# EAGLE design light (EAGLE 8.5.0)
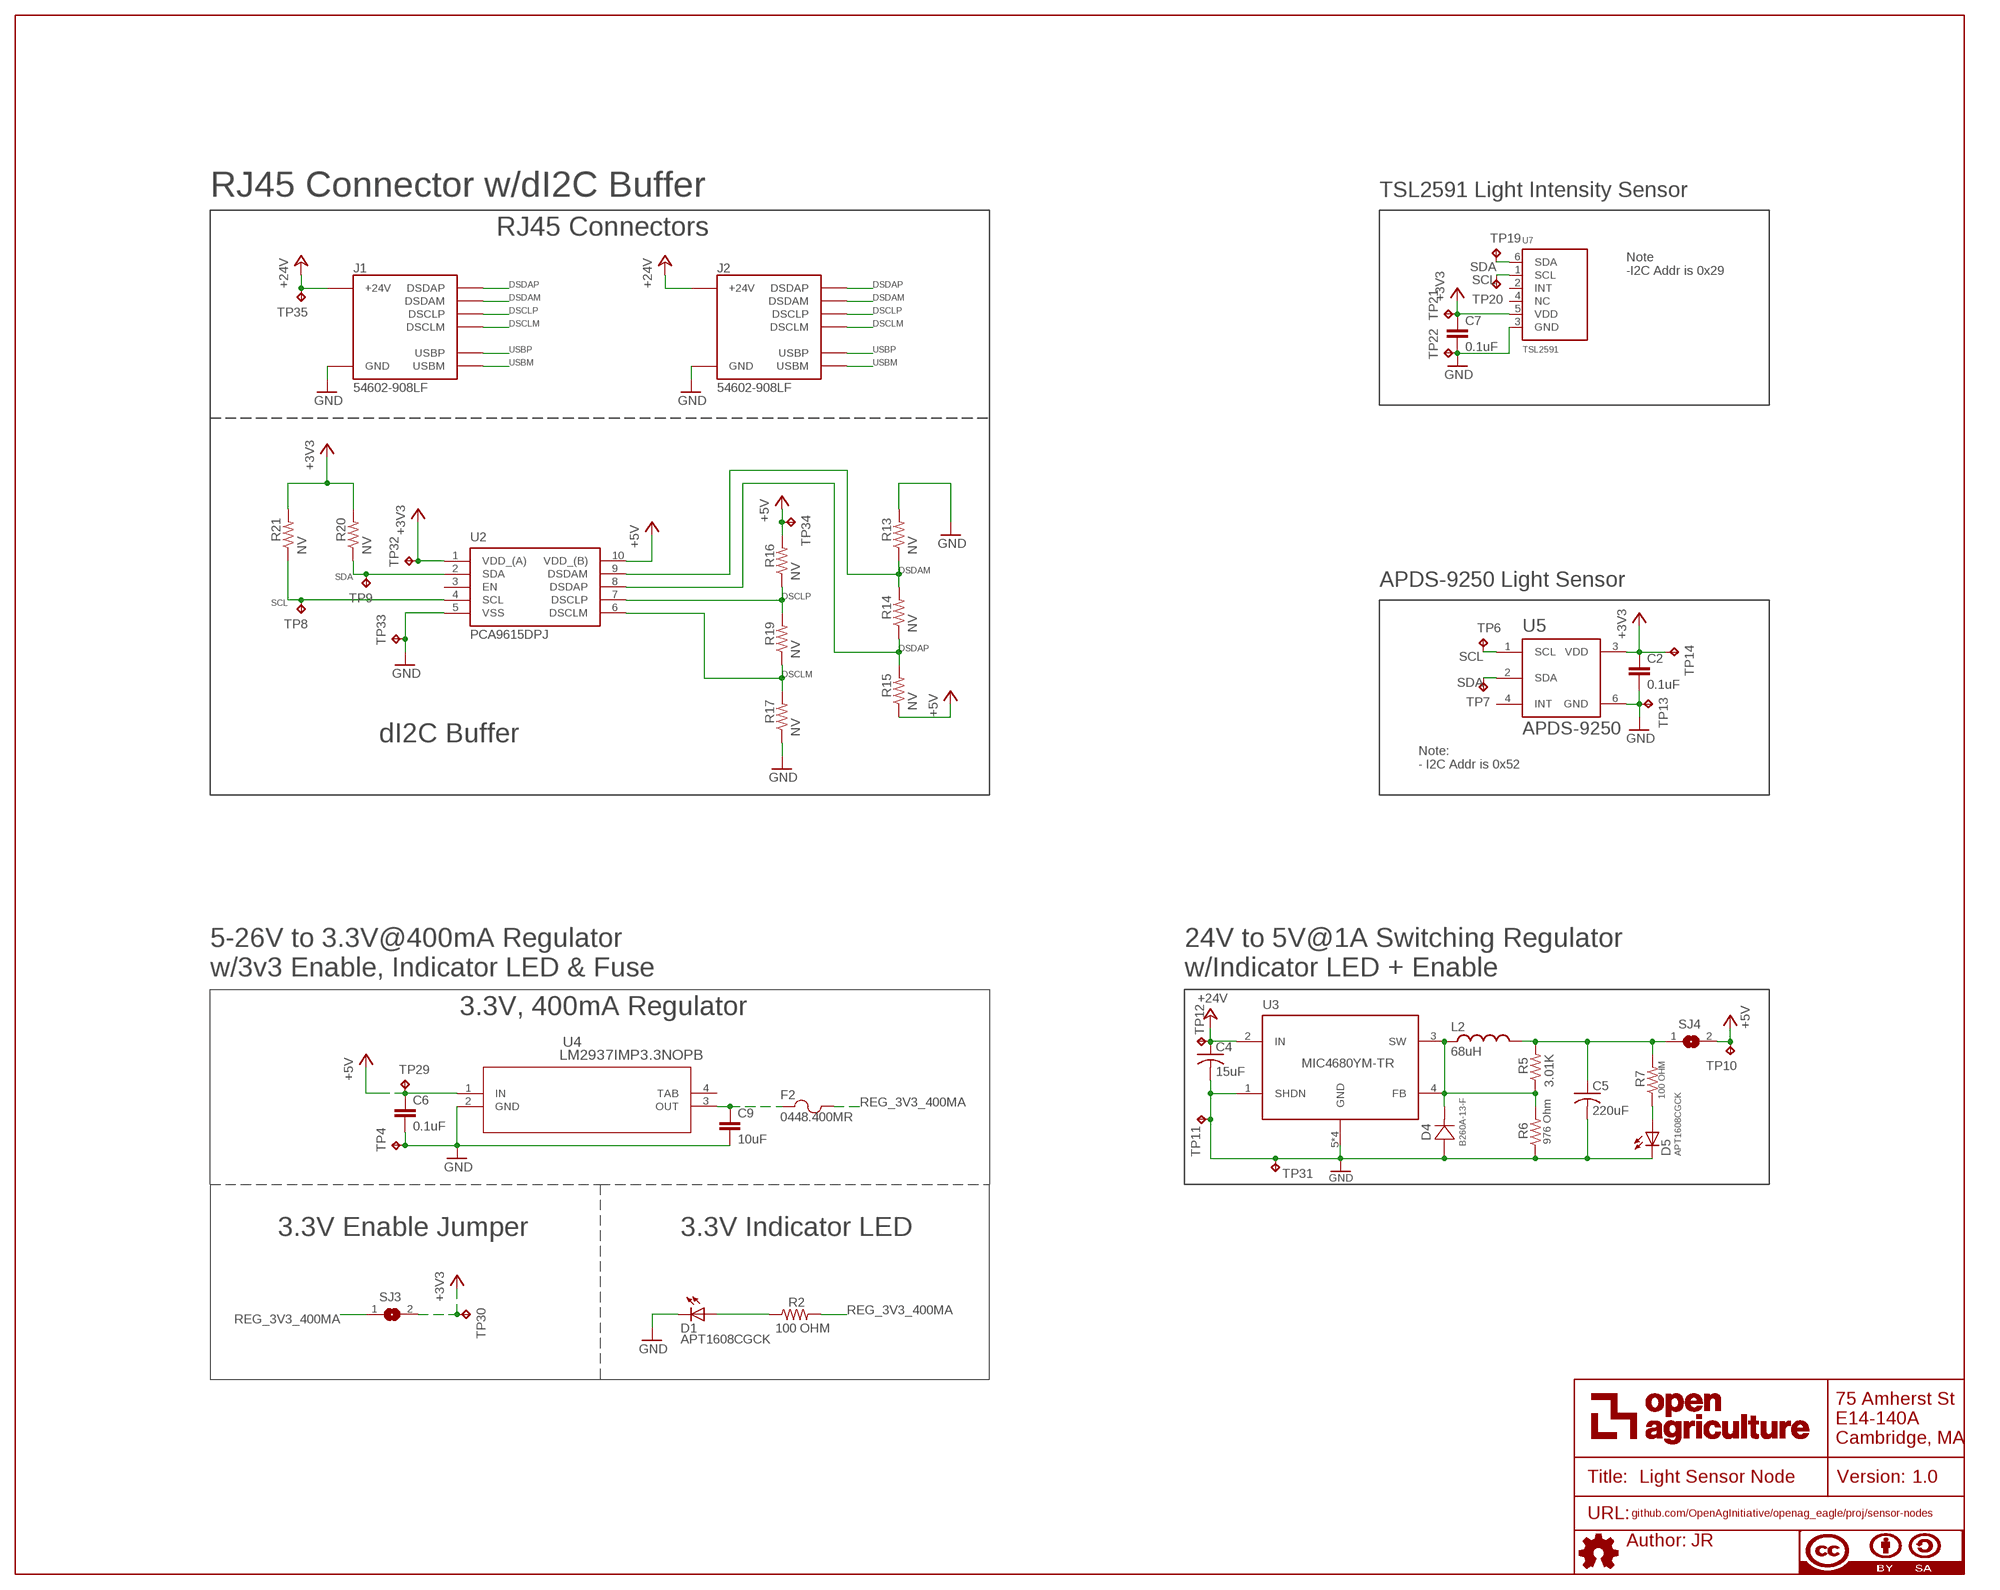
[diagram p0: schematic, sheet 1]

## Parts
C2  0.1uF  0.1UF-C0603C104K5RACTU  [C0603]
C4  15uF  15UF-TPSD156K035R0100  [CT7343]
C5  220uF  220UF-TPSY227K010R0100  [CT7343]
C6  0.1uF  0.1UF-C0603C104K5RACTU  [C0603]
C7  0.1uF  0.1UF-C0603C104K5RACTU  [C0603]
C9  10uF  10UF-GMK212BBJ106KG-T  [C0805]
D1  APT1608CGCK  [CHIPLED_0603]
D4  B260A-13-F  [SMA]
D5  APT1608CGCK  [CHIPLED_0603]
F2  0448.400MR  0438.375WR  [0603]
FRAME1  DOCFIELD  [DOCFIELD]
J1  54602-908LF  OPENAG-V1-RJ45PTH  [OPENAG-V1-RJ45]
J2  54602-908LF  OPENAG-V1-RJ45PTH  [OPENAG-V1-RJ45]
L2  68uH  68UH-UP2B-680-R  [UP2B]
R2  100 OHM  100OHM-RC0603JR-07100RL  [RC0603N]
R5  3.01K  3.01K-RC0603FR-073K01L  [RC0603N]
R6  976 Ohm  982OHM-RC0603FR-07976RL  [RC0603N]
R7  100 OHM  100OHM-RC0603JR-07100RL  [RC0603N]
R13  NV  R0603  [RC0603N]
R14  NV  R0603  [RC0603N]
R15  NV  R0603  [RC0603N]
R16  NV  R0603  [RC0603N]
R17  NV  R0603  [RC0603N]
R19  NV  R0603  [RC0603N]
R20  NV  R0603  [RC0603N]
R21  NV  R0603  [RC0603N]
SJ3  SOLDERJUMPERREFLOW_NOPASTE  [SOLDERJUMPER_REFLOW_NOPASTE]
SJ4  SOLDERJUMPERREFLOW_NOPASTE  [SOLDERJUMPER_REFLOW_NOPASTE]
TP4  TPTP06R  [TP06R]
TP6  TPTP06R  [TP06R]
TP7  TPTP06R  [TP06R]
TP8  TPTP06R  [TP06R]
TP9  TPTP06R  [TP06R]
TP10  TPTP06R  [TP06R]
TP11  TPTP06R  [TP06R]
TP12  TPTP06R  [TP06R]
TP13  TPTP06R  [TP06R]
TP14  TPTP06R  [TP06R]
TP19  TPTP06R  [TP06R]
TP20  TPTP06R  [TP06R]
TP21  TPTP06R  [TP06R]
TP22  TPTP06R  [TP06R]
TP29  TPTP06R  [TP06R]
TP30  TPTP06R  [TP06R]
TP31  TPTP06R  [TP06R]
TP32  TPTP06R  [TP06R]
TP33  TPTP06R  [TP06R]
TP34  TPTP06R  [TP06R]
TP35  TPTP06R  [TP06R]
U2  PCA9615DPJ  [SOP50P490X110-10N]
U3  MIC4680YM-TR  [SOIC8]
U4  LM2937IMP3.3NOPB  LM2937IMP-3.3/NOPB  [MP04A]
U5  APDS-9250  [APDS-9250]
U7  TSL2591  TSL25911FN  [DFN6_TAOS]

## Nets
+3V3: C2.1 C7.1 R20.2 R21.2 SJ3.2 TP14.TP TP21.TP TP30.TP TP32.TP U2.1(VDD_(A)) U5.3(VDD) U7.5(VDD)
+5V: C6.1 R15.1 R16.2 SJ4.2 TP10.TP TP29.TP TP34.TP U2.10(VDD_(B)) U4.1(IN)
+24V: C4.+(1(+)) J1.24V(6)(+24V) J2.24V(6)(+24V) TP12.TP TP35.TP U3.2(IN)
DSCLM: J1.DSCLM(5)(DSCLM) J2.DSCLM(5)(DSCLM) R17.2 R19.1 U2.6(DSCLM)
DSCLP: J1.DSCLP(4)(DSCLP) J2.DSCLP(4)(DSCLP) R16.1 R19.2 U2.7(DSCLP)
DSDAM: J1.DSDAM(2)(DSDAM) J2.DSDAM(2)(DSDAM) R13.1 R14.2 U2.9(DSDAM)
DSDAP: J1.DSDAP(1)(DSDAP) J2.DSDAP(1)(DSDAP) R14.1 R15.2 U2.8(DSDAP)
GND: C2.2 C4.-(2(-)) C5.-(2(-)) C6.2 C7.2 C9.2 D1.C D4.2 D5.C J1.GND(3)(GND) J2.GND(3)(GND) R6.1 R13.2 R17.1 TP4.TP TP11.TP TP13.TP TP22.TP TP31.TP TP33.TP U2.5(VSS) U3.1(SHDN) U3.5(GND) U3.6(GND) U3.7(GND) U3.8(GND) U4.2(GND) U5.6(GND) U7.3(GND)
N$4: D1.A R2.1
N$5: C9.1 F2.1 U4.3(OUT)
N$31: D4.1 L2.1 R5.1 R6.2 U3.3(SW) U3.4(FB)
N$32: D5.A R7.1
N$33: C5.+(1(+)) L2.2 R5.2 R7.2 SJ4.1
REG_3V3_400MA: F2.2 R2.2 SJ3.1
SCL: R21.1 TP6.TP TP8.TP TP20.TP U2.4(SCL) U5.1(SCL) U7.1(SCL)
SDA: R20.1 TP7.TP TP9.TP TP19.TP U2.2(SDA) U5.2(SDA) U7.6(SDA)
USBM: J1.USBM(8)(USBM) J2.USBM(8)(USBM)
USBP: J1.USBP(7)(USBP) J2.USBP(7)(USBP)
Unconnected: U2.3(EN) U5.4(INT) U7.2(INT) U7.4(NC)

## Notes on the sheet
- RJ45 Connector w/dI2C Buffer | TSL2591 Light Intensity Sensor
- RJ45 Connectors
- Note
  -I2C Addr is 0x29
- APDS-9250 Light Sensor
- dI2C Buffer
- Note:
  - I2C Addr is 0x52
- 5-26V to 3.3V@400mA Regulator 
  w/3v3 Enable, Indicator LED & Fuse
- 24V to 5V@1A Switching Regulator
  w/Indicator LED + Enable
- 3.3V, 400mA Regulator
- 3.3V Enable Jumper | 3.3V Indicator LED

## Power pins joined to a net without a drawn wire
TAB: U4.4(TAB)

## Library data of the parts
C2 C6 C7 = openag-capacitors:0.1UF-C0603C104K5RACTU: Kemet - C0603C104K5RACTU - CAP CER 0.1UF 50V X7R 0603 Description: 0.1µF ±10% 50V Ceramic Capacitor X7R 0603 (1608 Metric) Technical Specifications: Capacitance: 0.1µF Tolerance: ±10% Rated Voltage: 50V Temperature Coefficient: X7R Operating Temperature: -55°C ~ 125°C Package / Case: 0603 (1608 Metric) Datasheet(s): X7R Dielectric, 6.3-250 VDC <https://search.kemet.com/component-edge/download/datasheet/C0603C104K5RACTU.pdf> Vendor(s): Digikey: 399-5089-1-ND <https://www.digikey.com/product-detail/en/kemet/C0603C104K5RACTU/399-5089-1-ND/1465623>; POPULATE: YES; VERIFIED: NO
C4 = openag-capacitors:15UF-TPSD156K035R0100: AVX Corporation - TPSD156K035R0100 - CAP TANT 15UF 35V 10% 2917 Description: 15µF Molded Tantalum Capacitors 35V 2917 (7343 Metric) 100 mOhm Technical Specifications: Capacitance: 15µF Tolerance: ±10% Voltage - Rated: 35V Type: Molded ESR (Equivalent Series Resistance): 100 mOhm Operating Temperature: -55°C ~ 125°C Mounting Type: Surface Mount Package / Case: 2917 (7343 Metric) Size / Dimension: 0.287" L x 0.169" W (7.30mm x 4.30mm) Height - Seated (Max): 0.122" (3.10mm) Manufacturer Size Code: D Features: General Purpose Datasheet(s): TPS Series, Low ESR <http://datasheets.avx.com/TPS.pdf> Vendor(s): Digikey: 478-4100-1-ND <https://www.digikey.com/scripts/DkSearch/dksus.dll?Detail&itemSeq=250948407&uq=636531796868727362#>
C5 = openag-capacitors:220UF-TPSY227K010R0100: AVX Corporation - TPSY227K010R0100 - CAP TANT 220UF 10V 10% 2917 Description: 220µF Molded Tantalum Capacitors 10V 2917 (7343 Metric) 100 mOhm Technical Specifications: Capacitance: 220µF Tolerance: ±10% Voltage - Rated: 10V Type: Molded ESR (Equivalent Series Resistance): 100 mOhm Operating Temperature: -55°C ~ 125°C Mounting Type: Surface Mount Package / Case: 2917 (7343 Metric) Size / Dimension: 0.287" L x 0.169" W (7.30mm x 4.30mm) Height - Seated (Max): 0.079" (2.00mm) Manufacturer Size Code: Y Features: General Purpose Datasheet(s): TPS Series, Low ESR <http://datasheets.avx.com/TPS.pdf> Vendor(s): Digikey: 478-5408-1-ND <https://www.digikey.com/scripts/DkSearch/dksus.dll?Detail&itemSeq=250948888&uq=636531796868737363>
C9 = openag-capacitors:10UF-GMK212BBJ106KG-T: Taiyo Yuden - GMK212BBJ106KG-T - CAP CER 10UF 35V X5R 0805 Description: 10µF ±10% 35V Ceramic Capacitor X5R 0805 (2012 Metric) Technical Specifications: Capacitance: 10µF Tolerance: ±10% Rated Voltage: 35V Temperature Coefficient: X5R Operating Temperature: -55°C ~ 85°C Package / Case: 0805 (2012 Metric) Datasheet(s): GMK212BBJ106KG-T Spec <http://ds.yuden.co.jp/TYCOMPAS/ut/detail.do?productNo=GMK212BBJ106KG-T&fileName=GMK212BBJ106KG-T_SS&mode=specSheetDownload> Vendor(s): Digikey: 587-4893-1-ND <https://www.digikey.com/product-detail/en/taiyo-yuden/GMK212BBJ106KG-T/587-4893-1-ND/6563736>; POPULATE: YES; VERIFIED: NO
D1 D5 = openag-diodes:APT1608CGCK: Kingbright - APT1608CGCK - LED GREEN CLEAR 0603 SMD Description: Green 570nm LED Indication - Discrete 2.1V 0603 (1608 Metric) Technical Specifications: Color: Green Lens Color: Colorless Lens Transparency: Clear Millicandela Rating: 50mcd Lens Style/Size: Rectangle with Flat Top, 1.20mm x 0.80mm Voltage - Forward (Vf) (Typ): 2.1V Current - Test: 20mA Viewing Angle: 120° Mounting Type: Surface Mount Wavelength - Dominant: 570nm Wavelength - Peak: 574nm Package / Case: 0603 (1608 Metric) Supplier Device Package: Chip LED Size / Dimension: 1.60mm L x 0.80mm W Height (Max): 0.75mm Datasheet(s): APT1608CGCK <http://www.kingbrightusa.com/images/catalog/SPEC/APT1608CGCK.pdf> Vendor(s): Digikey: 754-1116-1-ND <https://www.digikey.com/product-detail/en/kingbright/APT1608CGCK/754-1116-1-ND/1747833#>; POPULATE: YES; VERIFIED: NO
D4 = openag-diodes:B260A-13-F: Diodes Incorporated - B260A-13-F - DIODE SCHOTTKY 60V 2A SMA Description: Diode Schottky 60V 2A Surface Mount SMA Technical Specifications: Diode Type: Schottky Voltage - DC Reverse (Vr) (Max): 60V Current - Average Rectified (Io): 2A Voltage - Forward (Vf) (Max) @ If: 700mV @ 2A Speed: Fast Recovery =< 500ns, > 200mA (Io) Current - Reverse Leakage @ Vr: 500µA @ 60V Capacitance @ Vr, F: 200pF @ 4V, 1MHz Mounting Type: Surface Mount Package / Case: DO-214AC, SMA Supplier Device Package: SMA Operating Temperature - Junction: -65°C ~ 150°C Base Part Number: B260 Datasheet(s): B220(A) - B260(A) <https://www.diodes.com/assets/Datasheets/ds13004.pdf> Vendor(s): Digikey: B260A-FDICT-ND <https://www.digikey.com/product-detail/en/B260A-13-F/B260A-FDICT-ND/755494>
F2 = openag-fuses:0438.375WR: Littelfuse Inc. - 0448.400MR - FUSE BOARD MNT 400MA 125VAC/VDC Description: FUSE BOARD MNT 400MA 125VAC/VDC Technical Specifications: Fuse Type: Board Mount (Cartridge Style Excluded) Current Rating: 400mA Voltage Rating - AC: 125V Voltage Rating - DC: 125V Response Time: Fast Package / Case: 2-SMD, Square End Block Mounting Type: Surface Mount Breaking Capacity @ Rated Voltage: 50A Melting I²t: 0.0416 Approvals: CSA, UL Operating Temperature: -55°C ~ 125°C Size / Dimension: 0.240" L x 0.106" W x 0.106" H (6.10mm x 2.69mm x 2.69mm) DC Cold Resistance: 0.4895 Ohms Datasheet(s): 448 Series Datasheet <http://www.littelfuse.com/~/media/electronics/datasheets/fuses/littelfuse_fuse_448_datasheet.pdf.pdf> Vendor(s): Digikey: F5573CT-ND <https://www.digikey.com/product-detail/en/littelfuse-inc/0448.400MR/F5573CT-ND/3306934>; POPULATE: YES; VERIFIED: YES
FRAME1 = openag-frames:DOCFIELD: DOCUMENT FIELD; AUTHOR: JR; TITLE: Light Sensor Node; URL: github.com/OpenAgInitiative/openag_eagle/proj/sensor-nodes; VER: 1.0
J1 J2 = openag_connector:OPENAG-V1-RJ45: Amphenol FCI - 54602-908LF - CONN MOD JACK 8P8C R/A UNSHLD Description: Jack Modular Connector 8p8c (RJ45, Ethernet) 90� Angle (Right) Unshielded Cat3 Technical Specifications: Connector Type: Jack Number of Positions/Contacts: 8p8c (RJ45, Ethernet) Number of Ports: 1 Number of Rows: 1 Mounting Type: Through Hole Orientation: 90� Angle (Right) Termination: Solder Shielding: Unshielded Ratings: Cat3 Features: Board Lock LED Color: Does Not Contain LED Tab Direction: Down Contact Material: Copper Alloy Contact Finish: Gold Contact Finish Thickness: 15�in (0.38�m) Housing Material: Polyester, Glass Filled Operating Temperature: -40�C ~ 70�C Datasheet(s): 54601-x04(zzz)WPLF Drawing <http://cdn.amphenol-icc.com/media/wysiwyg/files/drawing/c-bmj-0102.pdf> Vendor(s): Digikey: 609-1046-ND <https://www.digikey.com/product-detail/en/amphenol-fci/54602-908LF/609-1046-ND/1001360>; POPULATE: YES; VERIFIED: NO
L2 = openag-inductors:68UH-UP2B-680-R: Eaton - UP2B-680-R - FIXED IND 68UH 1.5A 178.7 MOHM Description: 68µH Unshielded Wirewound Inductor 1.5A 178.7 mOhm Max Nonstandard Technical Specifications: Type: Wirewound Material - Core: Ferrite Inductance: 68µH Tolerance: ±20% Current Rating: 1.5A Current - Saturation: 1.2A Shielding: Unshielded DC Resistance (DCR): 178.7 mOhm Max Operating Temperature: -40°C ~ 85°C Frequency - Test: 100kHz Mounting Type: Surface Mount Package / Case: Nonstandard Size / Dimension: 0.550" L x 0.410" W (13.97mm x 10.41mm) Height - Seated (Max): 0.236" (6.00mm) Datasheet(s): UNI-PAC (-R) <http://www.cooperindustries.com/content/dam/public/bussmann/Electronics/Resources/product-datasheets/BUS_Elx_PM_4308_UNI_PAC_Power_Inductors.pdf> Vendor(s): Digikey: 513-1083-1-ND <https://www.digikey.com/scripts/DkSearch/dksus.dll?Detail&itemSeq=250945518&uq=636531821133403587>
R2 R7 = openag-resistors:100OHM-RC0603JR-07100RL: Yageo - RC0603JR-07100RL - RES SMD 100 OHM 5% 1/10W 0603 Description: 100 Ohms ±5% 0.1W, 1/10W Chip Resistor 0603 (1608 Metric) Moisture Resistant Thick Film Technical Specifications: Resistance: 100 Ohms Tolerance: ±5% Power (Watts): 0.1W, 1/10W Composition: Thick Film Features: Moisture Resistant Temperature Coefficient: ±100ppm/°C Operating Temperature: -55°C ~ 155°C Package / Case: 0603 (1608 Metric) Supplier Device Package: 0603 Size / Dimension: 0.063" L x 0.032" W (1.60mm x 0.80mm) Height - Seated (Max): 0.022" (0.55mm) Number of Terminations: 2 Datasheet(s): Thick Film Chip Resistor Intro <http://www.yageo.com.tw/exep/pages/download/literatures/PYu-R_INT-thick_7.pdf> Chip Resistor Marking <http://www.yageo.com/exep/pages/download/literatures/PYu-R_Marking_2.pdf> RC Series, L Datasheet <http://www.yageo.com/documents/recent/PYu-RC_Group_51_RoHS_L_8.pdf> Vendor(s): Digikey: 311-100GRCT-ND <https://www.digikey.com/product-detail/en/yageo/RC0603JR-07100RL/311-100GRCT-ND/729644>; POPULATE: YES; VERIFIED: NO
R5 = openag-resistors:3.01K-RC0603FR-073K01L: Yageo - RC0603FR-073K01L - RES SMD 3.01K OHM 1% 1/10W 0603 Description: 3.01 kOhms ±1% 0.1W, 1/10W Chip Resistor 0603 (1608 Metric) Moisture Resistant Thick Film Technical Specifications: Resistance: 3.01 kOhms Tolerance: ±1% Power (Watts): 0.1W, 1/10W Composition: Thick Film Features: Moisture Resistant Temperature Coefficient: ±100ppm/°C Operating Temperature: -55°C ~ 155°C Package / Case: 0603 (1608 Metric) Supplier Device Package: 0603 Size / Dimension: 0.063" L x 0.032" W (1.60mm x 0.80mm) Height - Seated (Max): 0.022" (0.55mm) Number of Terminations: 2 Datasheet(s): Chip Resistor Marking <http://www.yageo.com/exep/pages/download/literatures/PYu-R_Marking_2.pdf> RC Series, L Datasheet <http://www.yageo.com/documents/recent/PYu-RC_Group_51_RoHS_L_8.pdf> Vendor(s): Digikey: 311-3.01KHRCT-ND <https://www.digikey.com/scripts/DkSearch/dksus.dll?Detail&itemSeq=250949714&uq=636531832410541188>
R6 = openag-resistors:982OHM-RC0603FR-07976RL: Yageo - RC0603FR-07976RL - RES SMD 976 OHM 1% 1/10W 0603 Description: 976 Ohms ±1% 0.1W, 1/10W Chip Resistor 0603 (1608 Metric) Moisture Resistant Thick Film Technical Specifications: Resistance: 976 Ohms Tolerance: ±1% Power (Watts): 0.1W, 1/10W Composition: Thick Film Features: Moisture Resistant Temperature Coefficient: ±100ppm/°C Operating Temperature: -55°C ~ 155°C Package / Case: 0603 (1608 Metric) Supplier Device Package: 0603 Size / Dimension: 0.063" L x 0.032" W (1.60mm x 0.80mm) Height - Seated (Max): 0.022" (0.55mm) Number of Terminations: 2 Datasheet(s): Chip Resistor Marking <http://www.yageo.com/exep/pages/download/literatures/PYu-R_Marking_2.pdf> RC Series, L Datasheet <http://www.yageo.com/documents/recent/PYu-RC_Group_51_RoHS_L_8.pdf> Vendor(s): Digikey: 311-976HRCT-ND <https://www.digikey.com/scripts/DkSearch/dksus.dll?Detail&itemSeq=250949870&uq=636531835229553061>
R13-R17 R19-R21 = openag-resistors:R0603: Placeholder 0603 Resistor
SJ3 SJ4 = openag-connectors:SOLDERJUMPER: SMD Solder JUMPER Solder the two pads together to create a connection, or remove the solder to break it. REFLOW - Use this footprint for solder paste and reflow ovens. WAVE - Use this footprint for hand-soldering (larger pads). CLOSED - Has a trace between the two pads to ensure it is closed by default. The trace needs to be cut to disable the jumper, and can be closed again by creating a solder bridge between the two pads.; POPULATE: YES; VERIFIED: NO
TP4 TP6-TP14 TP19-TP22 TP29-TP35 = openag-testpads:TP: Test pad
U2 = openag-buffers:PCA9615DPJ: NXP USA Inc. - PCA9615DPJ - IC REDRIVER I2C 2CH 10TSSOP Description: Buffer, ReDriver 2 Channel 400kHz 10-TSSOP Technical Specifications: Type: Buffer, ReDriver Applications: I²C Input: 2-Wire Bus Output: 2-Wire Bus Data Rate (Max): 400kHz Number of Channels: 2 Capacitance - Input: 7pF Voltage - Supply: 2.3 V ~ 5.5 V Current - Supply: 16µA Operating Temperature: -40°C ~ 85°C Package / Case: 10-TFSOP, 10-MSOP (0.118", 3.00mm Width) Supplier Device Package: 10-TSSOP Base Part Number: PCA9615 Datasheet(s): PCA9615DP <http://www.nxp.com/documents/data_sheet/PCA9615.pdf> Vendor(s): Digikey: 568-11484-1-ND <https://www.digikey.com/product-detail/en/nxp-usa-inc/PCA9615DPJ/568-11484-1-ND/4864508>
U3 = openag-regulators:MIC4680YM-TR: Microchip Technology - MIC4680YM-TR - IC REG BUCK BOOST ADJ 1.3A 8SOIC Description: Buck, Buck-Boost Switching Regulator IC Positive Adjustable 1.23V 1 Output 1.3A 8-SOIC (0.154", 3.90mm Width) Technical Specifications: Function: Step-Down, Step-Up/Step-Down Output Configuration: Positive Topology: Buck, Buck-Boost Output Type: Adjustable Number of Outputs: 1 Voltage - Input (Min): 4V Voltage - Input (Max): 34V Voltage - Output (Min/Fixed): 1.23V Voltage - Output (Max): 32.98V Current - Output: 1.3A Frequency - Switching: 200kHz Synchronous Rectifier: No Operating Temperature: -40°C ~ 125°C (TJ) Mounting Type: Surface Mount Package / Case: 8-SOIC (0.154", 3.90mm Width) Supplier Device Package: 8-SOIC Base Part Number: MIC4680 Datasheet(s): MIC4680 <http://www.microchip.com/mymicrochip/filehandler.aspx?ddocname=en579250> Vendor(s): Digikey: 576-1222-1-ND <https://www.digikey.com/scripts/DkSearch/dksus.dll?Detail&itemSeq=250950999&uq=636531791983475304>
U4 = openag-regulators:LM2937IMP-3.3/NOPB: Texas Instruments - LM2937IMP-3.3/NOPB - IC REG LIN 3.3V 400MA SOT223-4 Description: Linear Voltage Regulator IC Positive Fixed 1 Output 3.3V 400mA SOT-223-4 Technical Specifications: Output Configuration: Positive Output Type: Fixed Number of Regulators: 1 Voltage - Input (Max): 26V Voltage - Output (Min/Fixed): 3.3V Voltage Dropout (Max): 1V @ 50mA Current - Output: 400mA Current - Quiescent (Iq): 2mA Current - Supply (Max): 1.25A Protection Features: Over Temperature, Reverse Polarity, Short Circuit Operating Temperature: -40°C ~ 85°C Mounting Type: Surface Mount Package / Case: TO-261-4, TO-261AA Supplier Device Package: SOT-223-4 Base Part Number: LM2937 Datasheet(s): LM2937-2.5, LM2937-3.3 Datasheet <http://www.ti.com/lit/ds/symlink/lm2937-2.5.pdf> Vendor(s): Digikey: LM2937IMP-3.3/NOPBCT-ND <https://www.digikey.com/product-detail/en/texas-instruments/LM2937IMP-3.3-NOPB/LM2937IMP-3.3-NOPBCT-ND/270742#>; POPULATE: YES; VERIFIED: NO
U5 = openag-sensors:APDS-9250: Broadcom Limited - APDS-9250 - DIGITAL RGB, IR AND ALS Description: Optical Sensor Ambient 550nm I²C 6-SMD Module Technical Specifications: Type: Ambient Wavelength: 550nm Proximity Detection: No Output Type: I²C Voltage - Supply: 1.7 V ~ 3.6 V Operating Temperature: -40°C ~ 85°C Mounting Type: Surface Mount Package / Case: 6-SMD Module Datasheet(s): APDS-9250 <https://docs.broadcom.com/docs/AV02-4733EN> Vendor(s): Digikey: 516-3293-1-ND <https://www.digikey.com/product-detail/en/broadcom-limited/APDS-9250/516-3293-1-ND/5761192>; POPULATE: YES; VERIFIED: NO
U7 = openag-sensors:TSL25911FN: ams - TSL25911FN - IC LIGHT TO DGTL CONV 6-DFN Description: Optical Sensor Ambient I²C 6-WFDFN Technical Specifications: Type: Ambient Output Type: I²C Voltage - Supply: 2.7 V ~ 3.6 V Operating Temperature: -30°C ~ 70°C Mounting Type: Surface Mount Package / Case: 6-WFDFN Supplier Device Package: 6-DFN (2x2.2) Datasheet(s): TSl2591 Datasheet <http://ams.com/eng/content/download/389383/1251117/221135> Vendor(s): Digikey: TSL25911FNCT-ND <https://www.digikey.com/product-detail/en/ams/TSL25911FN/TSL25911FNCT-ND/4211515>; POPULATE: YES; VERIFIED: NO

## Board
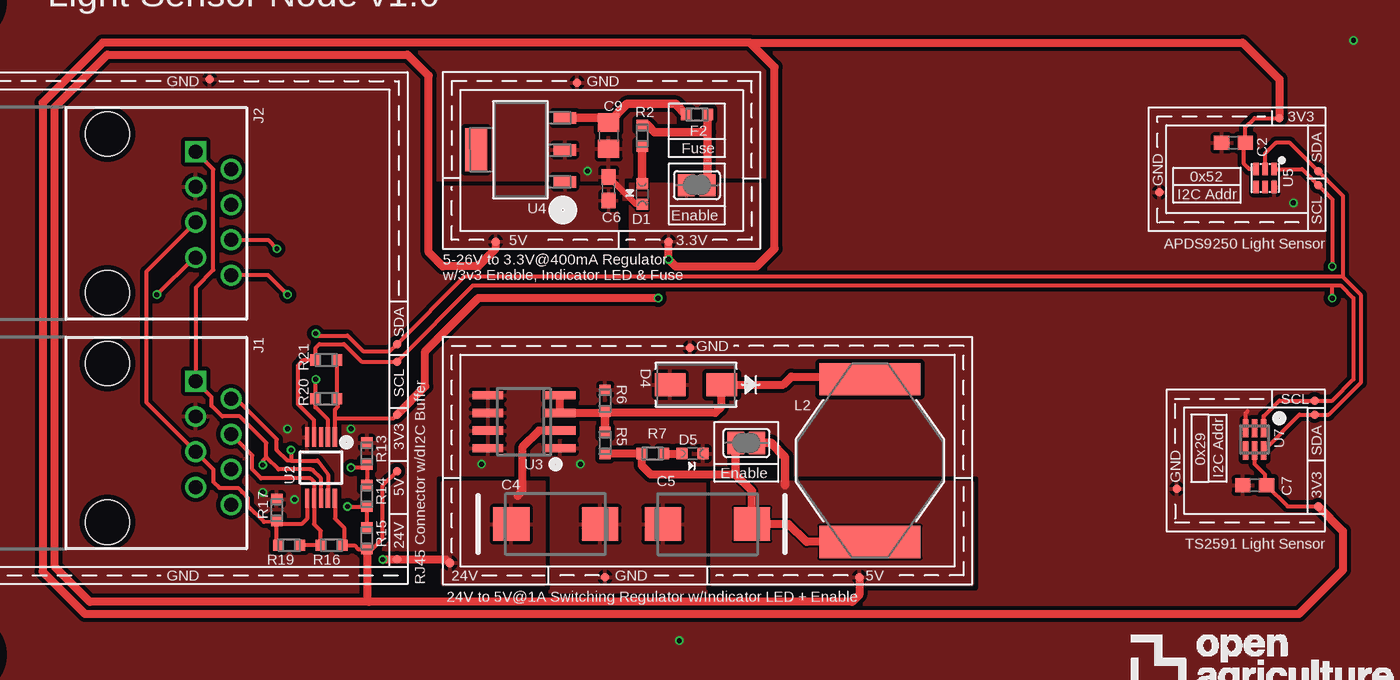
[diagram p1: board, top side]
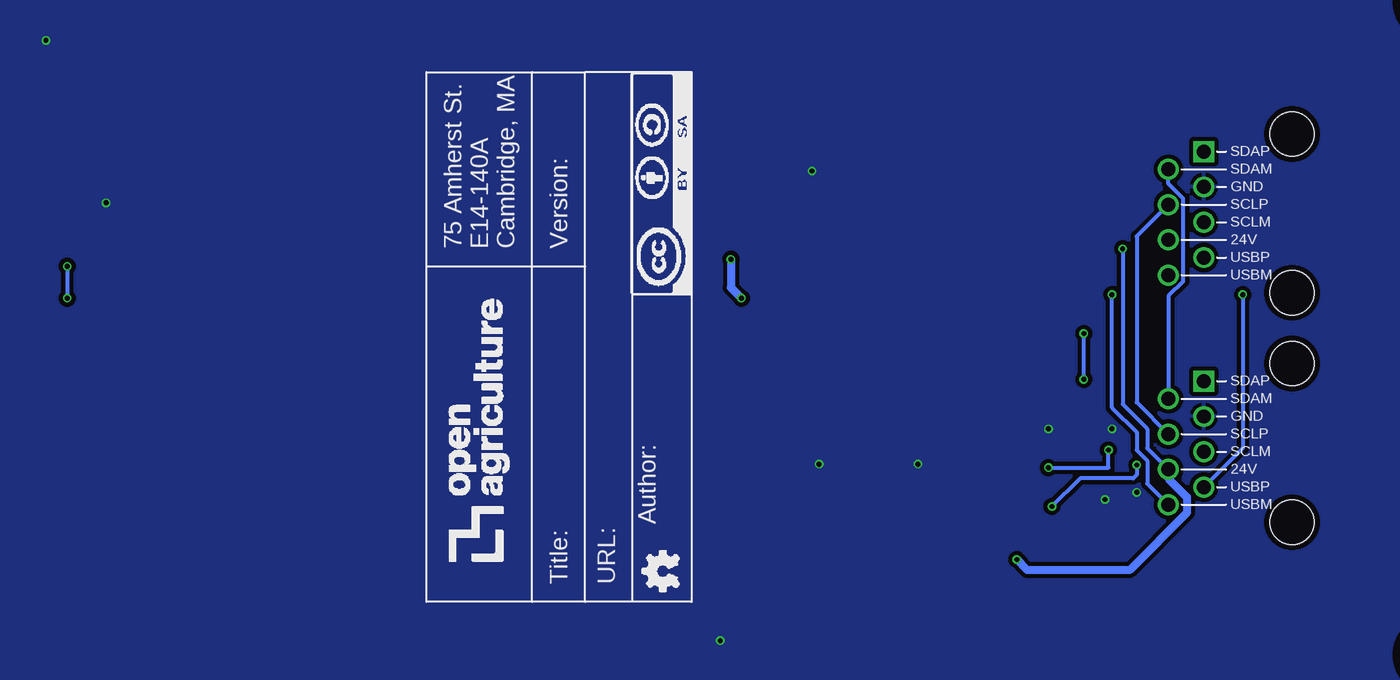
[diagram p2: board, bottom side, seen from below]

No outline drawn. Coordinates in mm, seen from the top.
Copper layers (1*16): Top 0.035559375mm / dielectric 1.6mm / Bottom 0.035559375mm
Design rules "oshpark-2layer-mask": minimum track width 6mil, minimum drill 10mil, track to track 6mil, track to pad 6mil, pad to pad 6mil, via to via 6mil, smd to smd 6mil, copper to edge 15mil, drill to drill 6mil, minimum pad ring 5mil, minimum via ring 5mil, stop-mask expansion 2.5mil, vias tented up to drill 20mil, thermal gap 10mil

### Footprints (pad centres in the part's own frame; a part is rotated, then mirrored left to right if it is on the bottom)
C0603 = smd 1.1 x 1: 1 -0.85,0; 2 0.85,0
CT7343 = smd 2.6 x 2.4: + -3.2,0; - 3.2,0
C0805 = smd 1.3 x 1.5: 1 -0.95,0; 2 0.95,0
CHIPLED_0603 = smd 0.8 x 0.8: A 0,-0.75; C 0,0.75
SMA = smd 2.18 x 1.63: 1 -1.857,0; 2 1.857,0
0603 = smd 0.756 x 0.8: 1 -0.778,0; 2 0.778,0
OPENAG-V1-RJ45 = drill 1: 24V(6) 1.905,8.89; DSCLM(5) 0.635,6.35; DSCLP(4) -0.635,8.89; DSDAM(2) -3.175,8.89; GND(3) -1.905,6.35; USBM(8) 4.445,8.89; USBP(7) 3.175,6.35 | drill 1 square: DSDAP(1) -4.445,6.35 | hole 3.2: -5.715,0; 5.715,0
UP2B = smd 2.311 x 7.29: 1 -5.855,0; 2 5.855,0
RC0603N = smd 0.756 x 0.8: 1 -0.778,0; 2 0.778,0
SOLDERJUMPER_REFLOW_NOPASTE = smd 1.168 x 1.6: 1 -0.762,0; 2 0.762,0
TP06R = smd 0.6 x 0.6: TP 0,0
SOP50P490X110-10N = smd 1.4 x 0.3: 1 -2.2,1; 2 -2.2,0.5; 3 -2.2,0; 4 -2.2,-0.5; 5 -2.2,-1; 6 2.2,-1; 7 2.2,-0.5; 8 2.2,0; 9 2.2,0.5; 10 2.2,1
SOIC8 = smd 0.6 x 2.2: 1 -1.905,-2.6; 2 -0.635,-2.6; 3 0.635,-2.6; 4 1.905,-2.6; 5 1.905,2.6; 6 0.635,2.6; 7 -0.635,2.6; 8 -1.905,2.6
MP04A = smd 1.6 x 0.838: 1 -3.2,2.3; 2 -3.2,0; 3 -3.2,-2.3 | smd 1.6 x 3.099: 4 3.2,0
APDS-9250 = smd 0.4 x 0.9: 1 -0.65,-0.65; 2 0,-0.65; 3 0.65,-0.65; 4 0.65,0.65; 5 0,0.65; 6 -0.65,0.65
DFN6_TAOS = smd 1.3 x 0.4: 1 -0.8,0.65; 2 -0.8,0; 3 -0.8,-0.65; 4 0.8,-0.65; 5 0.8,0; 6 0.8,0.65
OPENAG-CORNER-MOUNTING-HOLE = hole 3.81: 0,0

### Placement (x,y rotation side)
C2  91.19,39.37 180 top
C4  42.42,11.94 0 top
C5  53.34,11.94 180 top
C6  46.23,36.07 90 top
C7  92.71,14.73 180 top
C9  46.23,39.88 270 top
D1  48.64,35.69 180 top
D4  52.51,21.97 180 top
D5  52.26,17.02 270 top
F2  52.58,41.4 0 top
FRAME1  53.34,6.35 90 bottom
J1  10.16,17.78 270 top
J2  10.16,34.29 270 top
L2  65.02,16.51 270 top
R2  48.64,39.88 90 top
R5  45.97,17.78 270 top
R6  45.97,20.83 270 top
R7  49.4,17.02 180 top
R13  28.83,17.02 90 top
R14  28.83,13.97 90 top
R15  28.83,10.92 90 top
R16  26.29,10.41 0 top
R17  22.35,12.95 270 top
R19  23.24,10.41 0 top
R20  25.91,20.95 0 top
R21  25.91,23.75 0 top
SJ3  52.58,36.32 180 top
SJ4  56.13,17.78 0 top
TP4  43.94,43.69 180 top
TP6  97.28,36.32 180 top
TP7  97.28,37.34 180 top
TP8  30.99,23.62 0 top
TP9  30.99,24.89 0 top
TP10  64.26,8.13 180 top
TP11  52.07,24.64 180 top
TP12  34.8,9.14 180 top
TP13  85.85,35.81 180 top
TP14  94.49,41.15 180 top
TP19  97.03,19.81 180 top
TP20  97.03,20.83 180 top
TP21  97.28,13.21 180 top
TP22  87.12,14.48 180 top
TP29  38.1,32.26 180 top
TP30  50.55,32.26 180 top
TP31  45.97,8.13 180 top
TP32  30.99,19.81 0 top
TP33  17.53,43.94 0 top
TP34  30.99,15.75 0 top
TP35  30.99,9.4 0 top
U2  25.53,16 270 top
U3  40.13,19.3 90 top
U4  39.88,38.86 180 top
U5  93.47,36.83 180 top
U7  92.71,18.03 270 top
U$1  [OPENAG-CORNER-MOUNTING-HOLE]  0,2.54 0 top
U$2  [OPENAG-CORNER-MOUNTING-HOLE]  0,49.53 270 top
U$3  [OPENAG-CORNER-MOUNTING-HOLE]  109.22,2.54 90 top
U$4  [OPENAG-CORNER-MOUNTING-HOLE]  109.22,49.53 180 top
U$5  [OPENAG-LOGO-750-MIL]  83.82,0 0 top

### Tracks (layer width: path | path; a pad name or v marks a point on that pad's centre or on a via)
+3V3  (via drill 0.35)
  Top 0.305: U2.1 26.53,19.56 | 26.53,19.56 26.53,20.18 26.76,20.41 26.76,20.88 R20.2 R21.2 | TP32.TP 30.73,19.56 26.53,19.56 | U5.3 92.31,37.48 91.95,37.85 91.95,39.28 C2.1 92.04,40.47 92.71,41.15 TP14.TP | U7.5 92.71,16.26 93.47,15.49 93.47,14.82 C7.1 95.08,13.21 TP21.TP
  Top 0.559: 56.39,46.58 9.8,46.58 5.49,42.27 5.49,8.53 8.53,5.49 95.91,5.49 99.06,8.64 99.06,11.43 TP21.TP | TP32.TP 33.02,21.84 33.02,24.38 36.83,28.19 v49.78,28.19 | TP30.TP v50.55,30.99 51.05,30.48 56.9,30.48 58.17,31.75 58.17,44.81 56.39,46.58 | TP14.TP 94.49,43.94 91.85,46.58 56.39,46.58
  Bottom 0.559: v50.55,30.99 50.55,28.96 v49.78,28.19
  pour Top: 47.75,31.75 47.75,36.45 57.15,36.45 57.15,31.75
+5V
  Top 0.305: U2.10 26.53,12.34 27.18,11.68 27.18,10.45 R16.2 27.94,10.41 28.21,10.14 R15.1 29.19,10.14 29.97,10.92 29.97,14.73 TP34.TP
  Top 0.559: TP10.TP 64.26,6.86 63.75,6.35 28.96,6.35 | 28.96,6.35 8.89,6.35 6.35,8.89 6.35,41.91 10.16,45.72 31.75,45.72 33.27,44.2 33.27,31.5 34.29,30.48 36.83,30.48 38.1,31.75 TP29.TP | R15.1 28.83,6.48 28.96,6.35
  Top 0.61: SJ4.2 57.91,17.78 58.93,16.76 58.93,14.73
  pour Top: 72.39,7.62 72.39,14.92 53.66,14.92 53.66,7.62
  pour Top: 46.86,31.75 46.86,36.2 34.29,36.2 34.29,31.75
+24V  (via drill 0.35)
  Top 0.305: J2.24V(6) 21.72,32.38 v22.35,31.75
  Top 0.559: U3.2 41.21,18.67 40.01,17.46 40.01,14.29 39.69,13.97 | v29.97,9.4 TP35.TP 34.54,9.4 TP12.TP
  Bottom 0.305: v22.35,31.75 22.35,20.57 20.57,18.8 20.57,17.4 J1.24V(6) 19.05,15.22
  Bottom 0.559: 19.05,15.22 17.72,13.89 17.72,12.76 21.84,8.64 29.21,8.64 v29.97,9.4
  pour Top: 34.29,7.62 41.59,7.62 41.59,14.92 34.29,14.92
DSCLM
  Top 0.305: R19.1 22.35,10.45 22.35,11.94 | 22.35,11.94 R17.2 21.42,12.1 20.26,13.27 20.26,13.84 19.84,14.25 19.55,14.54 18.22,14.54 17.78,14.99 17.78,15.88 J1.DSCLM(5) 12.95,20.7 12.95,30.1 J2.DSCLM(5) | U2.6 24.53,12.34 24.13,11.94 22.35,11.94
DSCLP
  Top 0.305: R19.2 R16.1 25.51,11.45 25.03,11.94 U2.7 25.03,14.98 24.77,15.24 21.21,15.24 20.57,15.88 20.57,16.89 J1.DSCLP(4)
  Bottom 0.305: J2.DSCLP(4) 21.34,32.64 21.34,20.7 J1.DSCLP(4)
DSDAM  (via drill 0.35)
  Top 0.305: 23.37,16.51 25.27,16.51 26.04,15.49 U2.9 | R14.2 R13.1 arc-90 28.66,16 v27.69,16 27.56,16 | v23.37,17.27 23.37,16.51 | 23.37,16.51 23.11,16.51 22.35,17.27 22.35,18.03 19.43,20.95 J1.DSDAM(2)
  Bottom 0.305: v27.69,16 23.37,16 v23.37,17.27 | J2.DSDAM(2) 19.05,36.42 18,35.36 18,29.41 19.05,28.35 J1.DSDAM(2)
DSDAP  (via drill 0.35)
  Top 0.305: R15.2 R14.1 27.45,13.19 v27.43,13.21 | 21.59,16.76 22.48,15.88 24.77,15.88 24.94,15.82 25.53,15.24 U2.8 | 21.59,16.76 21.59,17.78 19.68,19.68 18.41,19.68 17.65,20.45 17.65,21.08 J1.DSDAP(1) 16.51,28.96 17.78,30.23 17.78,37.47 J2.DSDAP(1) | 21.59,16.76 21.33,16.51 v21.33,16.19
  Bottom 0.305: v27.43,13.21 25.4,15.24 21.59,15.24 21.33,15.5 v21.33,16.19
GND  (via drill 0.35)
  Top 0.305: U7.3 92.06,19.92 92.2,20.07
  Top 0.406: D1.C 48.21,34.94 C6.2
  other vias: 44.2,16.26 37.08,16.26 23.11,18.8 27.69,18.8 23.62,13.72 21.34,14.22 44.7,37.34 51.31,3.56 99.82,46.74 95.5,35.05
  pour Bottom (isolate 0.406): 34.29,7.62 72.39,7.62 72.39,25.4 34.29,25.4
  pour Top (isolate 0.406, rank 3): 57.15,31.75 57.15,44.45 34.29,44.45 34.29,31.75
  pour Top (isolate 0.406, rank 2): 72.39,25.4 34.29,25.4 34.29,7.62 72.39,7.62
  pour Bottom (isolate 0.406): 72.39,25.4 34.29,25.4 34.29,7.62 72.39,7.62
  pour Top (isolate 0.305, rank 3): -3.81,-1.27 113.03,-1.27 113.03,53.34 -3.81,53.34
  pour Top (isolate 0.305): -2.54,7.62 31.75,7.62 31.75,44.45 -2.54,44.45
  pour Bottom (isolate 0.305): 31.75,7.62 31.75,44.45 -2.54,44.45 -2.54,7.62
  pour Bottom (isolate 0.305, rank 3): -3.81,-1.27 113.03,-1.27 113.03,53.34 -3.81,53.34
  pour Top (isolate 0.305): 97.79,41.91 97.79,33.02 85.09,33.02 85.09,41.91
  pour Top (isolate 0.305): 86.36,21.59 86.36,11.43 97.79,11.43 97.79,21.59
N$4
  Top 0.61: D1.A R2.1
N$5
  Top 0.61: 46.05,41.16 C9.1 | C9.1 45.89,41.16 U4.3 | F2.1 51.04,42.16 47.56,42.16 C9.1
N$31
  Top 0.559: 45.86,19.94 U3.3 U3.4 | 45.86,19.94 R6.2 | L2.1 64.85,22.54 59.37,22.54 58.8,21.97 D4.1 54.29,21.89 54.29,20.32 53.91,19.94 45.86,19.94
  Top 0.61: R5.1 R6.2
N$32
  Top 0.559: R7.1 D5.A
N$33
  Top 0.559: L2.2 60.47,10.65 59.18,11.94 C5.+ 56.54,14.33 55.36,15.51 49.26,15.51 48.62,16.14 R7.2 48.61,17 R5.2
  Top 0.61: SJ4.1 55.36,17.76 55.36,15.51
REG_3V3_400MA
  Top 0.61: SJ3.1 53.36,40.13 | 53.36,40.13 F2.2 | R2.2 49.01,40.66 49.53,40.13 53.36,40.13
SCL  (via drill 0.35)
  Top 0.305: U2.4 25.03,19.42 23.88,20.57 23.88,23.37 24.26,23.75 R21.1 25.15,23.77 25.15,24.64 25.4,24.89 27.18,24.89 28.45,23.62 TP8.TP 36.47,29.11 98.3,29.11 | U7.1 93.36,19.7 94.49,20.83 TP20.TP 98.3,20.83 99.82,22.35 99.82,28.19 98.91,29.11 98.3,29.11 | U5.1 96.12,37.48 TP6.TP 98.3,35.31 v98.3,30.48 | v98.3,28.19 98.3,29.11
  Bottom 0.305: v98.3,30.48 v98.3,28.19
SDA  (via drill 0.35)
  Top 0.305: U2.2 26.03,19.44 25.13,20.34 R20.1 25.13,22.34 v25.15,22.35 | v25.15,25.65 25.3,25.5 27.43,25.5 28.55,24.38 30.48,24.38 TP9.TP 35.81,29.72 99.06,29.72 | U5.2 93.47,38.61 94.23,39.37 95.25,39.37 TP7.TP 99.06,35.56 99.06,29.72 | U7.6 95.94,19.81 TP19.TP 98.04,19.81 100.33,22.1 100.33,28.45 99.06,29.72
  Bottom 0.305: v25.15,22.35 v25.15,25.65
USBM  (via drill 0.35)
  Top 0.305: v23.11,28.45 21.72,29.84 J2.USBM(8)
  Bottom 0.305: v23.11,28.45 23.11,20.32 21.34,18.54 21.34,17.27 20.57,16.5 20.57,14.86 J1.USBM(8)
USBP  (via drill 0.35)
  Top 0.305: v13.72,28.45 16.38,31.11 J2.USBP(7)
  Bottom 0.305: v13.72,28.45 13.72,17.4 J1.USBP(7)

### Text on the board
tPlace: Light Sensor Node v1.0 | GND | GND | 3V3 | SDA | Fuse | GND | 0x52 | I2C Addr | SCL | Enable | 5V | 3.3V | APDS9250 Light Sensor | 5-26V to 3.3V@400mA Regulator / w/3v3 Enable, Indicator LED & Fuse | EDGE | SDA | GND | SCL | SCL | I2C Addr | 0x29 | SDA | 3V3 | GND | Enable | 3V3 | 5V | TS2591 Light Sensor | 24V | GND | 24V | GND | 5V | RJ45 Connector w/dI2C Buffer | 24V to 5V@1A Switching Regulator w/Indicator LED + Enable